# EAGLE design projek (EAGLE 9.6.2)
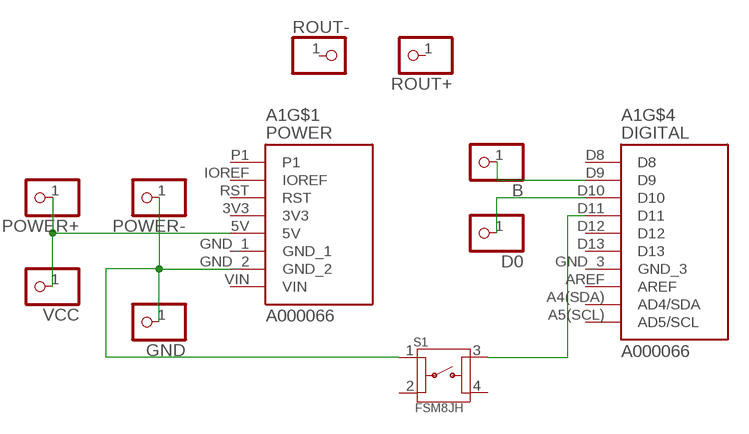
[diagram p0: schematic, sheet 1]

## Parts
A1  A000066  [ARDUINO_A000066]
B  PINHD-1X1  [1X01]
D0  PINHD-1X1  [1X01]
GND  PINHD-1X1  [1X01]
POWER+  PINHD-1X1  [1X01]
POWER-  PINHD-1X1  [1X01]
ROUT+  PINHD-1X1  [1X01]
ROUT-  PINHD-1X1  [1X01]
S1  FSM8JH  [SW_FSM8JH]
VCC  PINHD-1X1  [1X01]

## Nets
N$1: A1.D9 B.1
N$2: A1.D10 D0.1
N$3: A1.5V POWER+.1 VCC.1
N$4: A1.GND_2 GND.1 POWER-.1 S1.1
N$5: A1.D11 S1.3
Unconnected: A1.A0 A1.A1 A1.A2 A1.A3 A1.A4 A1.A4(SDA)(AD4/SDA) A1.A5 A1.A5(SCL)(AD5/SCL) A1.AREF A1.D0 A1.D1 A1.D2 A1.D3 A1.D4 A1.D5 A1.D6 A1.D7 A1.D8 A1.D12 A1.D13 A1.IOREF A1.P1 A1.RST ROUT+.1 ROUT-.1 S1.2 S1.4

## Power pins joined to a net without a drawn wire
3V3: A1.3V3
GND_1: A1.GND_1
GND_3: A1.GND_3
VIN: A1.VIN

## Library data of the parts
A1 = A000066:A000066: Microcontroller board, Uno [Arduino] A000066 Microcontroller board, Uno 7640152110092 Check prices <https://pricing.snapeda.com/parts/A000066/Arduino/view-part?ref=eda> Check prices <https://pricing.snapeda.com/parts/A000066/Arduino/view-part?ref=eda> Check availability <https://pricing.snapeda.com/parts/ARDUINO%20UNO%20REV3/Arduino/view-part?ref=eda>; AVAILABILITY: In Stock; CHECK_PRICES: https://www.snapeda.com/parts/ARDUINO%20UNO%20REV3/Arduino/view-part/?ref=eda; DESCRIPTION: Microcontroller board based on the ATmega328P.; MF: Arduino; MP: ARDUINO UNO REV3; PACKAGE: Non-Standard Arduino; PRICE: None; SNAPEDA_LINK: https://www.snapeda.com/parts/ARDUINO%20UNO%20REV3/Arduino/view-part/?ref=snap
B D0 GND POWER+ POWER- ROUT+ ROUT- VCC = pinhead:PINHD-1X1: PIN HEADER
S1 = FSM8JH:FSM8JH: Switch, Pushbutton, Tactile, SPST, Thru Hole, Vertical, 6MM, Black Check availability <https://pricing.snapeda.com/parts/FSM8JH/TE%20Connectivity/view-part?ref=eda>; AVAILABILITY: In Stock; CHECK_PRICES: https://www.snapeda.com/parts/FSM8JH/TE+Connectivity+ALCOSWITCH+Switches/view-part/?ref=eda; DESCRIPTION: Switch,Pushbutton,Tactile,SPST,Thru Hole,Vertical,6MM,Black | TE Connectivity FSM8JH; MF: TE Connectivity; MP: FSM8JH; PACKAGE: None; PRICE: None; SNAPEDA_LINK: https://www.snapeda.com/parts/FSM8JH/TE+Connectivity+ALCOSWITCH+Switches/view-part/?ref=snap

## Board
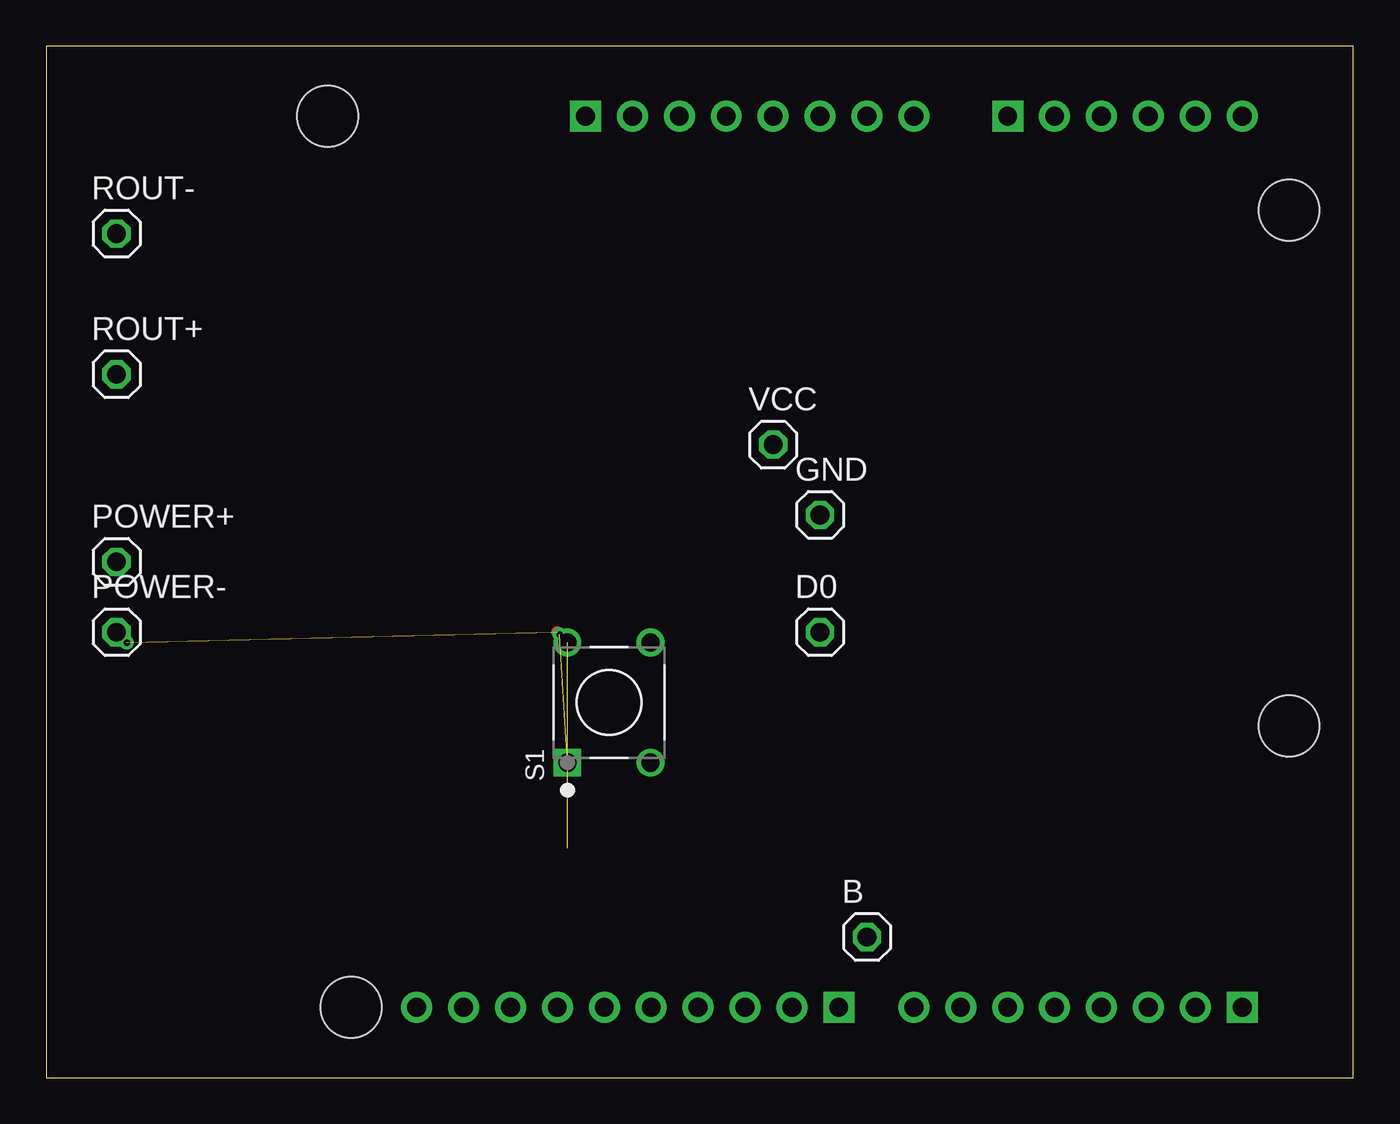
[diagram p1: board, top side]
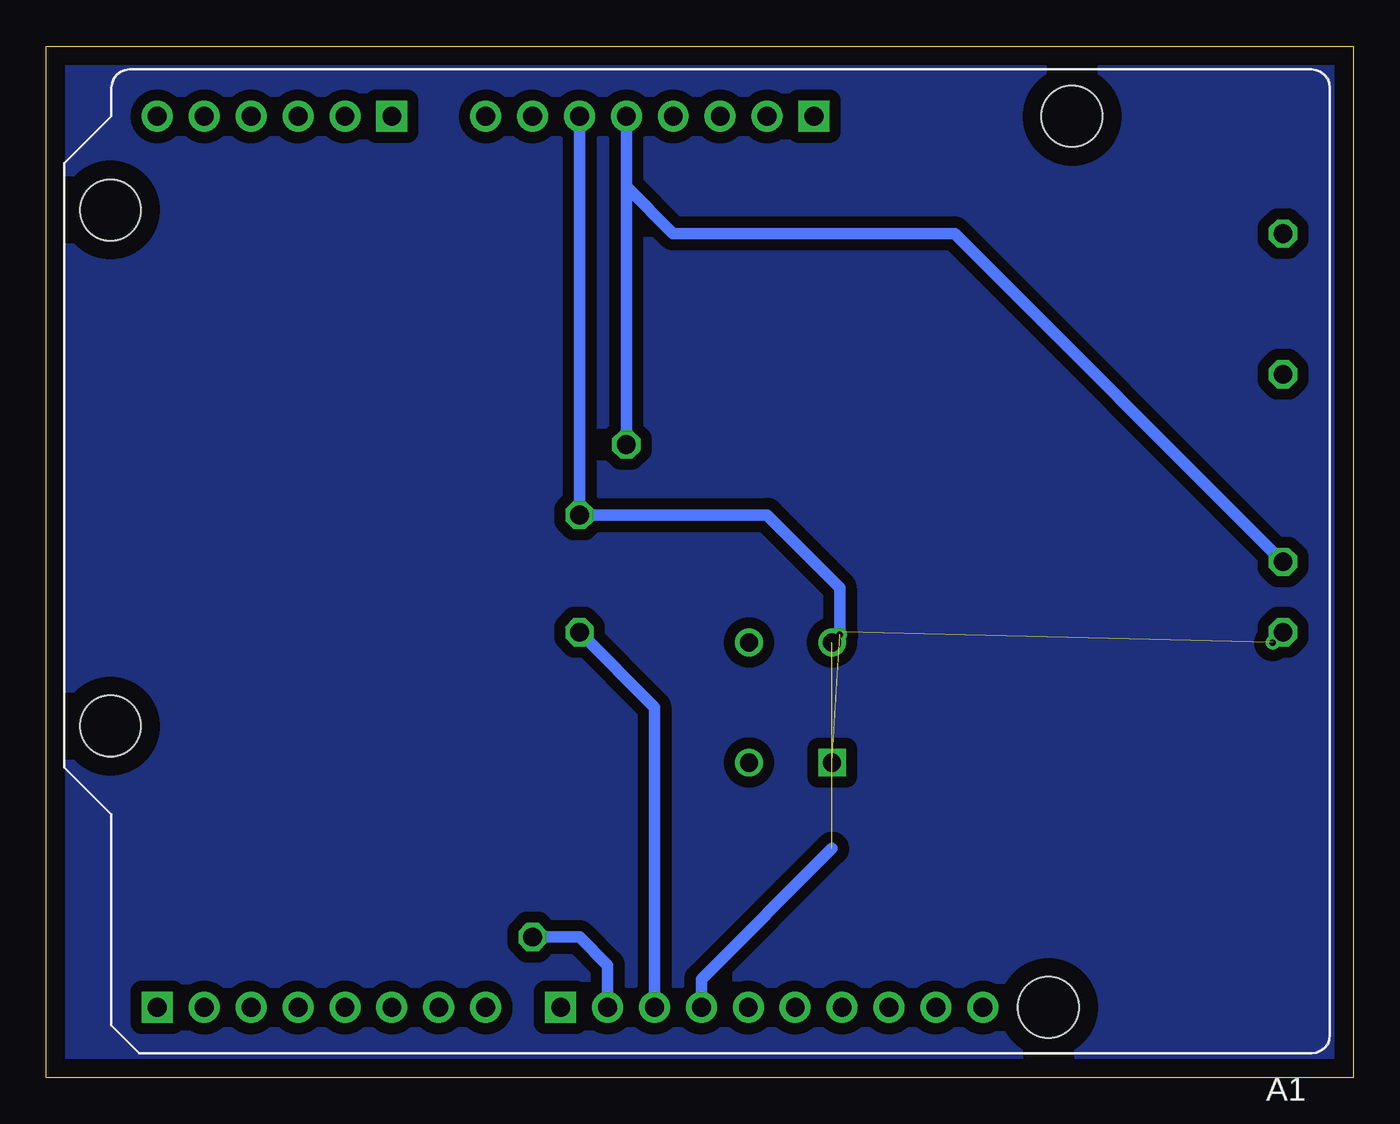
[diagram p2: board, bottom side, seen from below]

Size 70.79 x 55.87 mm. Coordinates in mm from the lower left corner, seen from the top.
Outline: 0,0 70.79,0 70.79,55.87 0,55.87 0,0
Copper layers (1*16): Top 0.035mm / dielectric 1.5mm / Bottom 0.035mm
Design rules "default": minimum track width 6mil, minimum drill 0.35mm, track to track 6mil, track to pad 6mil, pad to pad 6mil, via to via 6mil, smd to smd 6mil, copper to edge 40mil, drill to drill 6mil, minimum pad ring 10mil, minimum via ring 8mil, stop-mask expansion 4mil, vias tented up to drill 0mil, thermal gap 10mil

### Footprints (pad centres in the part's own frame; a part is rotated, then mirrored left to right if it is on the bottom)
ARDUINO_A000066 = drill 1.016 pad 1.676: 3V3 35.56,2.54; 5V 38.1,2.54; A1 53.34,2.54; A2 55.88,2.54; A3 58.42,2.54; A4 60.96,2.54; A4(SDA) 21.336,50.8; A5 63.5,2.54; A5(SCL) 18.796,50.8; AREF 23.876,50.8; D1 60.96,50.8; D2 58.42,50.8; D3 55.88,50.8; D4 53.34,50.8; D5 50.8,50.8; D6 48.26,50.8; D7 45.72,50.8; D9 39.116,50.8; D10 36.576,50.8; D11 34.036,50.8; D12 31.496,50.8; D13 28.956,50.8; GND_1 43.18,2.54; GND_2 40.64,2.54; GND_3 26.416,50.8; IOREF 30.48,2.54; RST 33.02,2.54; VIN 45.72,2.54 | drill 1.016 pad 1.676 square: A0 50.8,2.54; D0 63.5,50.8; D8 41.656,50.8; P1 27.94,2.54 | hole 3.3: 66.04,35.56; 66.04,7.62; 15.24,50.8; 13.97,2.54
1X01 = drill 1.016 octagon: 1 0,0
SW_FSM8JH = drill 0.99 square: 1 -3.25,2.25 | drill 0.99: 2 -3.25,-2.25; 3 3.25,2.25; 4 3.25,-2.25

### Placement (x,y rotation side)
A1  1.27,54.61 180 bottom
B  44.45,7.62 0 top
D0  41.91,24.13 0 top
GND  41.91,30.48 0 top
POWER+  3.81,27.94 0 top
POWER-  3.81,24.13 0 top
ROUT+  3.81,38.1 0 top
ROUT-  3.81,45.72 0 top
S1  30.48,20.32 90 top
VCC  39.37,34.29 0 top

### Tracks (layer width: path | path; a pad name or v marks a point on that pad's centre or on a via)
GND
  pour Bottom (isolate 0.61): 0,55.88 71.12,55.88 71.12,0 0,0
N$1
  Bottom 0.61: B.1 41.91,7.62 40.39,6.1 A1.D9
N$2
  Bottom 0.61: D0.1 37.85,20.07 A1.D10
N$3
  Bottom 0.61: POWER+.1 21.59,45.72 36.83,45.72 39.37,48.26 | 39.37,48.26 A1.5V | VCC.1 39.37,48.26
N$4  (via drill 0.35)  (2 unrouted)
  Top 0.61: 27.67,24.13 v27.8,24 | v4.37,23.57 POWER-.1
  Bottom 0.61: A1.GND_2 GND.1 31.75,30.48 27.8,26.54 v27.8,24
N$5  (1 unrouted)
  Bottom 0.61: A1.D11 35.31,5.33 28.23,12.41